# EAGLE schematic LSPPM (EAGLE 9.5.0), part 2 of 2
## Sheet 18 of 19
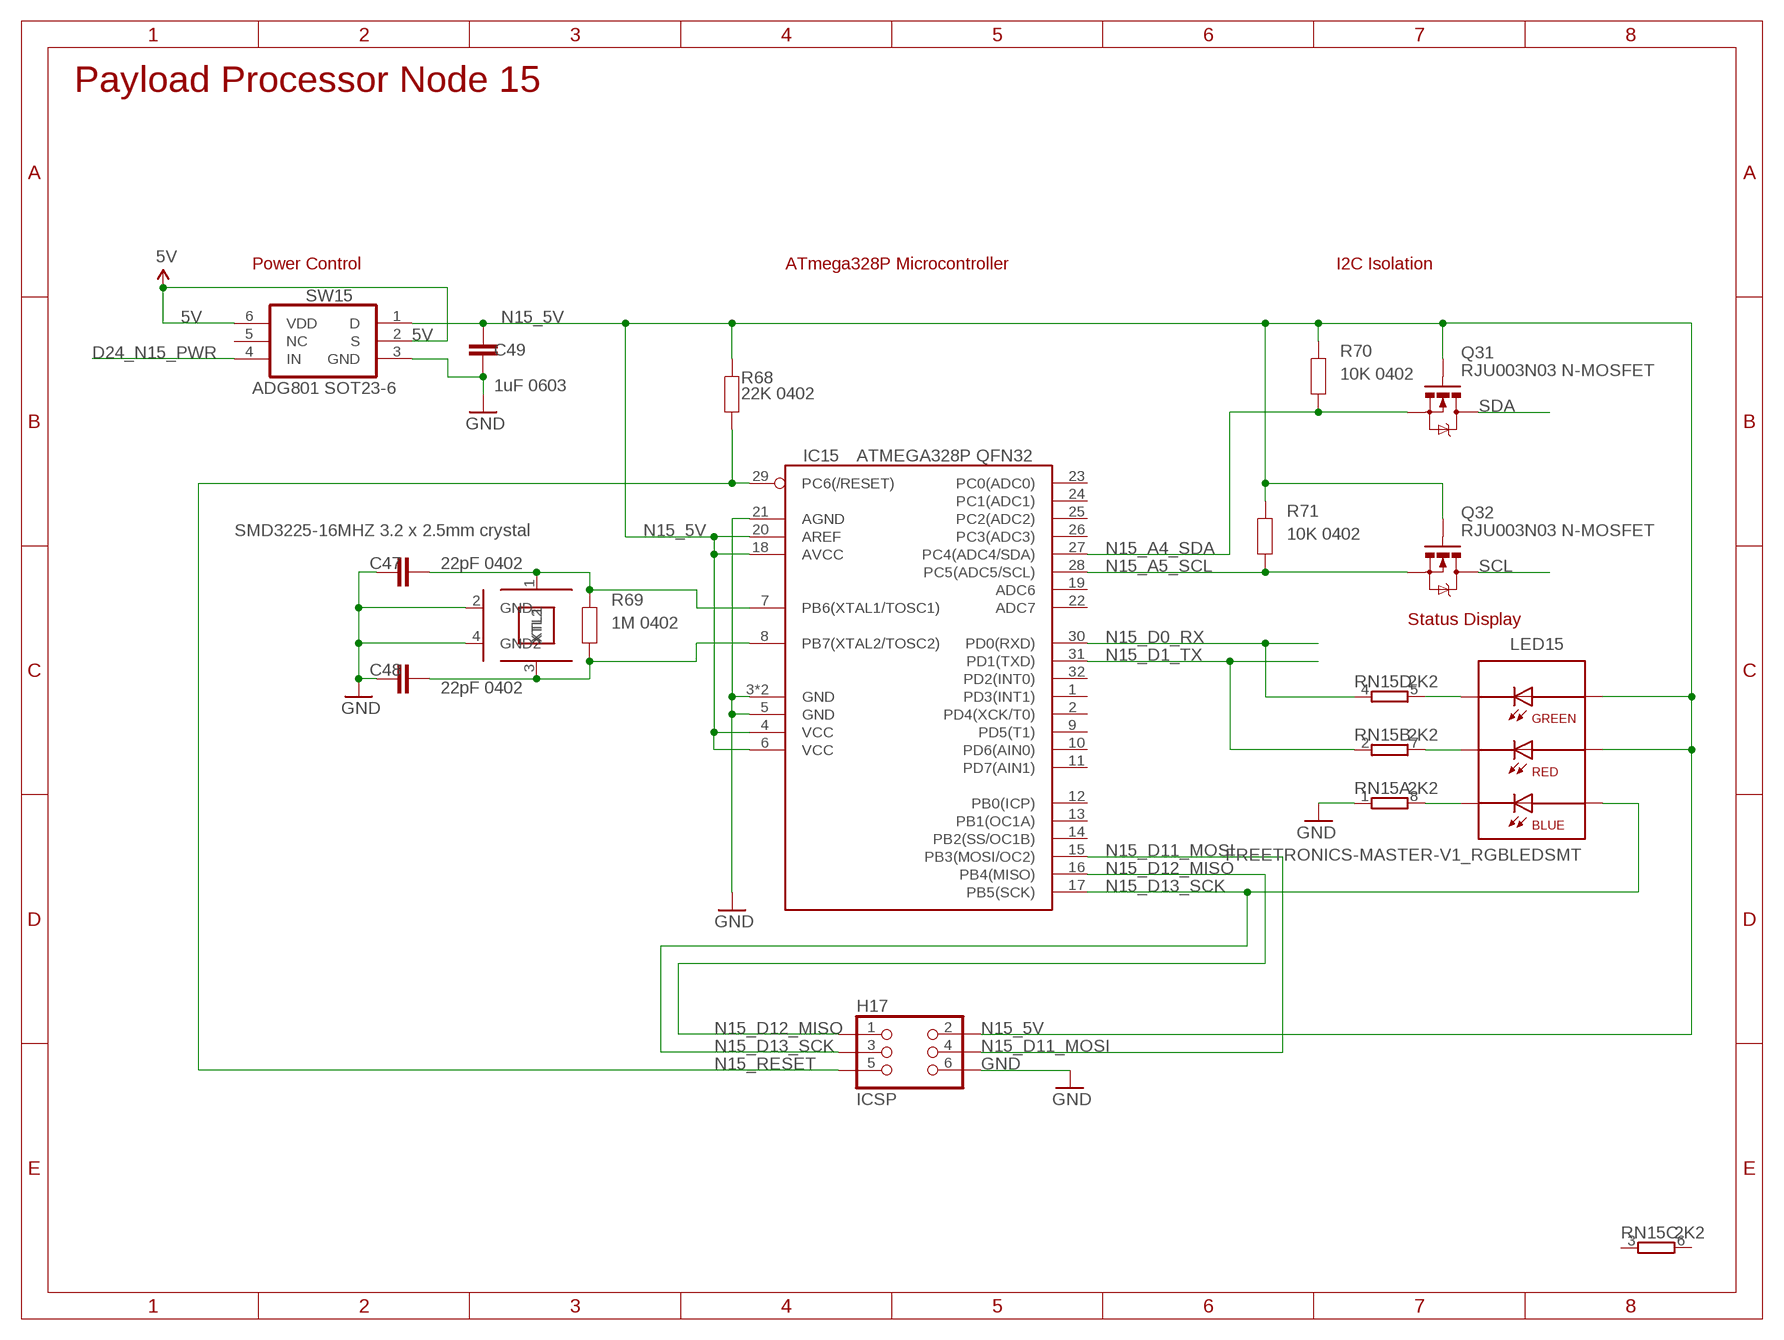
[diagram p17: schematic, sheet 18]

### Parts
C47  22pF 0402  CAP0402  [C0402]
C48  22pF 0402  CAP0402  [C0402]
C49  1uF 0603  CAP0603  [C0603]
H17  ICSP  ICSP2X3-2MM  [M2X3-2MM]
IC15  ATMEGA328P QFN32  ATMEGA8-MLF  [MLF32]
LED15  FREETRONICS-MASTER-V1_RGBLEDSMT  [FREETRONICS-MASTER-V1_19-337]
Q31  RJU003N03 N-MOSFET  MOSFET-NCHANNEL-323  [SOT32-3]
Q32  RJU003N03 N-MOSFET  MOSFET-NCHANNEL-323  [SOT32-3]
R68  22K 0402  RESISTOR0402  [R0402]
R69  1M 0402  RESISTOR0402  [R0402]
R70  10K 0402  RESISTOR0402  [R0402]
R71  10K 0402  RESISTOR0402  [R0402]
RN15  2K2  4R-NCAY16  [CAY16]
SW15  ADG801 SOT23-6  ADG801SOT23-6  [SOT23-6]
XTL15  SMD3225-16MHZ 3.2 x 2.5mm crystal  CRYSTAL-GND3X2  [CRYSTAL-SMD-3X2]

### Nets
5V: SW15.2(S) SW15.6(VDD) ; also sheet 1,2,3,4,5,6,7,8,9,10,11,12,13,14,15,16,17,19
D24_N15_PWR: SW15.4(IN) ; also sheet 2
GND: C47.1 C48.1 C49.2 H17.6 IC15.3(GND) IC15.5(GND) IC15.21(AGND) IC15.TGND(GND) RN15.1 SW15.3(GND) XTL15.2(GND) XTL15.4(GND2) ; also sheet 1,2,3,4,5,6,7,8,9,10,11,12,13,14,15,16,17,19
N15_5V: C49.1 H17.2 IC15.4(VCC) IC15.6(VCC) IC15.18(AVCC) IC15.20(AREF) LED15.5(A-R) LED15.6(A-G) Q31.1(G) Q32.1(G) R68.2 R70.2 R71.2 SW15.1(D)
N15_A4_SDA: IC15.27(PC4(ADC4/SDA)) Q31.2(S) R70.1
N15_A5_SCL: IC15.28(PC5(ADC5/SCL)) Q32.2(S) R71.1
N15_D0_RX: IC15.30(PD0(RXD)) RN15.4 ; also sheet 2
N15_D1_TX: IC15.31(PD1(TXD)) RN15.2 ; also sheet 2
N15_D11_MOSI: H17.4 IC15.15(PB3(MOSI/OC2))
N15_D12_MISO: H17.1 IC15.16(PB4(MISO))
N15_D13_SCK: H17.3 IC15.17(PB5(SCK)) LED15.4(A-B)
N15_RESET: H17.5 IC15.29(PC6(/RESET)) R68.1 ; also sheet 3
N$8822: C48.2 IC15.8(PB7(XTAL2/TOSC2)) R69.1 XTL15.3(XTL2)
N$8823: C47.2 IC15.7(PB6(XTAL1/TOSC1)) R69.2 XTL15.1(XTL1)
N$8824: LED15.2(C-R) RN15.7
N$8825: LED15.1(C-B) RN15.8
N$8826: LED15.3(C-G) RN15.5
SCL: Q32.3(D) ; also sheet 1,2,3,4,5,6,7,8,9,10,11,12,13,14,15,16,17,19
SDA: Q31.3(D) ; also sheet 1,2,3,4,5,6,7,8,9,10,11,12,13,14,15,16,17,19
Unconnected: IC15.1(PD3(INT1)) IC15.2(PD4(XCK/T0)) IC15.9(PD5(T1)) IC15.10(PD6(AIN0)) IC15.11(PD7(AIN1)) IC15.12(PB0(ICP)) IC15.13(PB1(OC1A)) IC15.14(PB2(SS/OC1B)) IC15.19(ADC6) IC15.22(ADC7) IC15.23(PC0(ADC0)) IC15.24(PC1(ADC1)) IC15.25(PC2(ADC2)) IC15.26(PC3(ADC3)) IC15.32(PD2(INT0)) RN15.3 RN15.6 SW15.5(NC)

### Notes on the sheet
- Payload Processor Node 15
- Power Control | ATmega328P Microcontroller | I2C Isolation
- SMD3225-16MHZ 3.2 x 2.5mm crystal
- Status Display

## Sheet 19 of 19
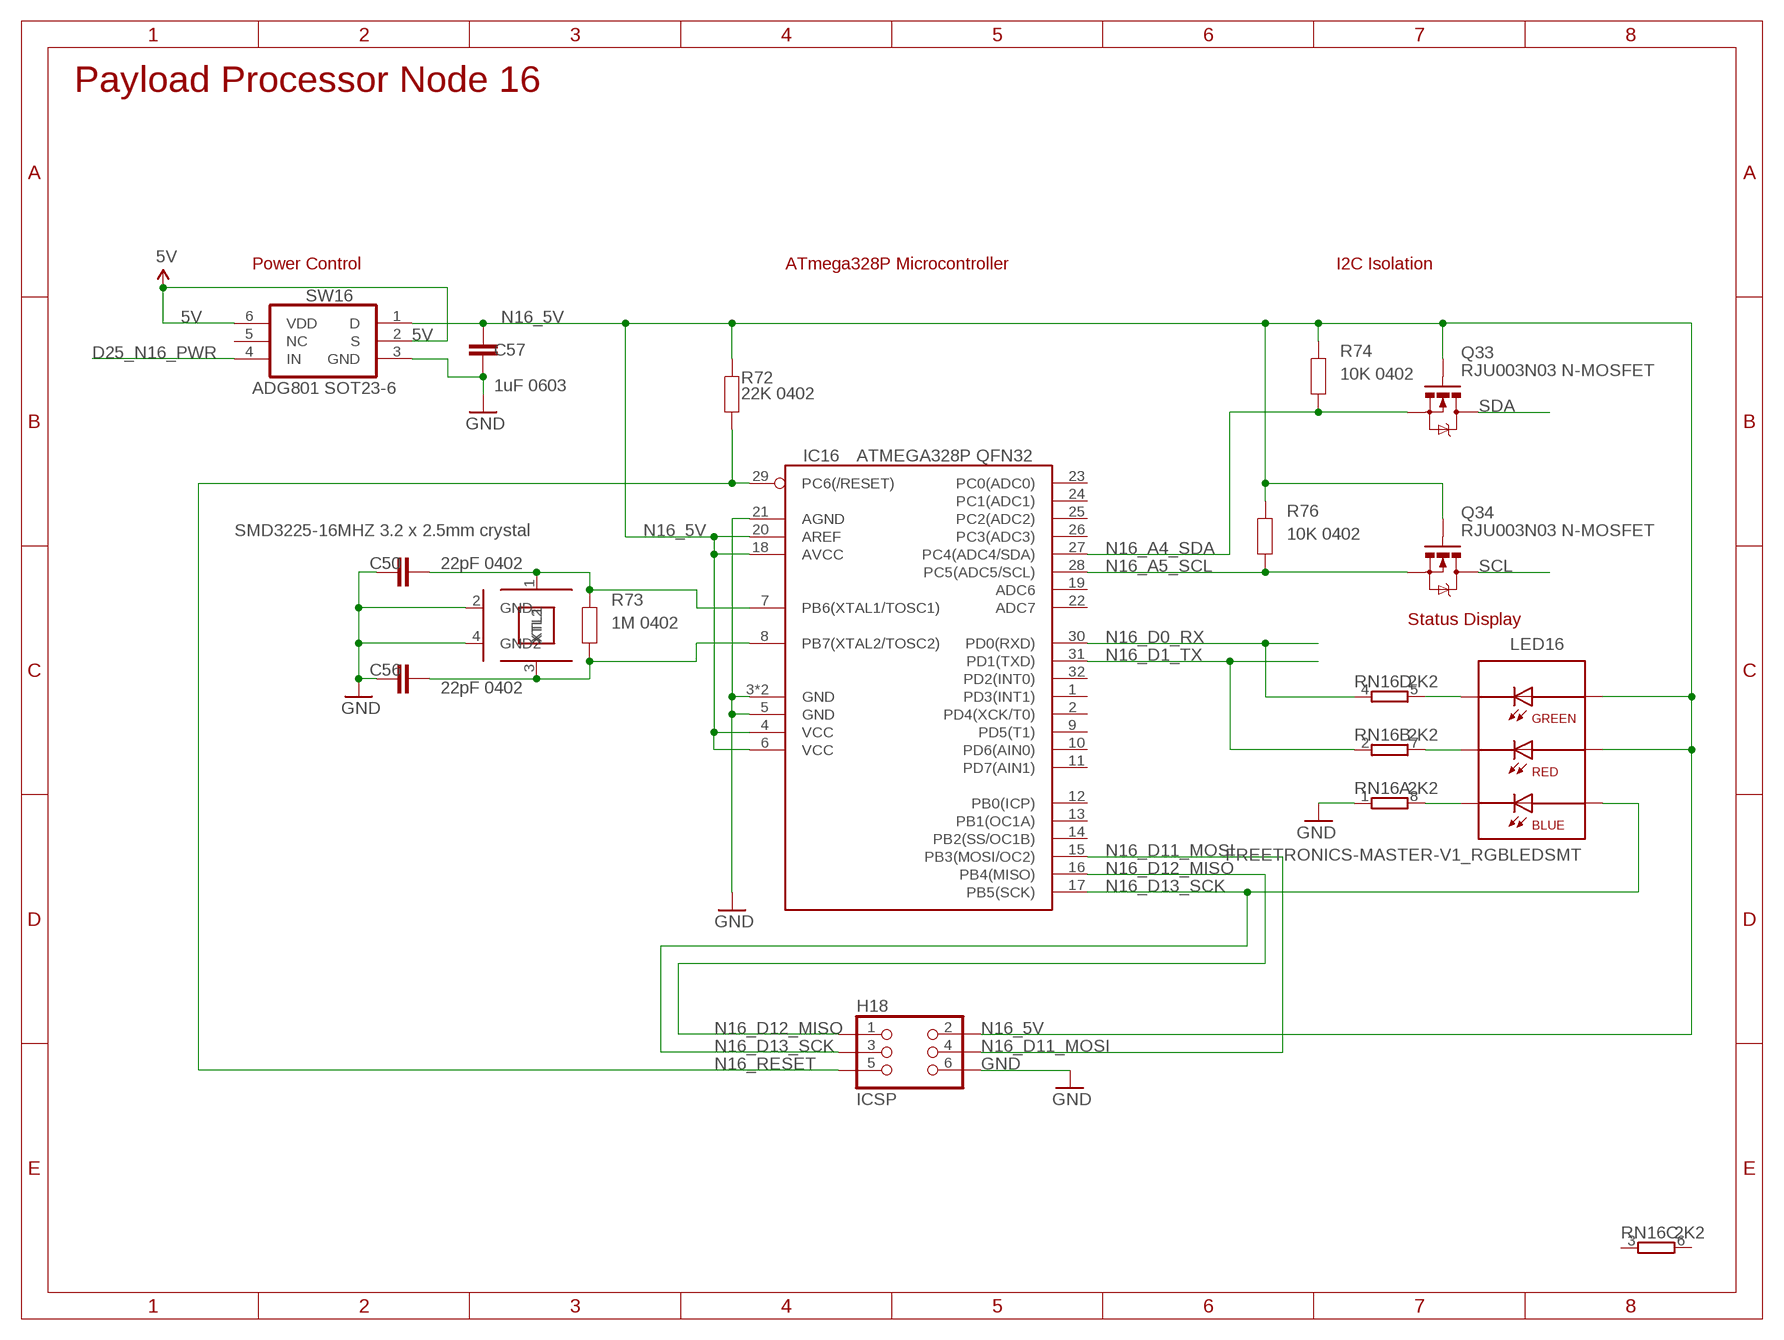
[diagram p18: schematic, sheet 19]

### Parts
C50  22pF 0402  CAP0402  [C0402]
C56  22pF 0402  CAP0402  [C0402]
C57  1uF 0603  CAP0603  [C0603]
H18  ICSP  ICSP2X3-2MM  [M2X3-2MM]
IC16  ATMEGA328P QFN32  ATMEGA8-MLF  [MLF32]
LED16  FREETRONICS-MASTER-V1_RGBLEDSMT  [FREETRONICS-MASTER-V1_19-337]
Q33  RJU003N03 N-MOSFET  MOSFET-NCHANNEL-323  [SOT32-3]
Q34  RJU003N03 N-MOSFET  MOSFET-NCHANNEL-323  [SOT32-3]
R72  22K 0402  RESISTOR0402  [R0402]
R73  1M 0402  RESISTOR0402  [R0402]
R74  10K 0402  RESISTOR0402  [R0402]
R76  10K 0402  RESISTOR0402  [R0402]
RN16  2K2  4R-NCAY16  [CAY16]
SW16  ADG801 SOT23-6  ADG801SOT23-6  [SOT23-6]
XTL16  SMD3225-16MHZ 3.2 x 2.5mm crystal  CRYSTAL-GND3X2  [CRYSTAL-SMD-3X2]

### Nets
5V: SW16.2(S) SW16.6(VDD) ; also sheet 1,2,3,4,5,6,7,8,9,10,11,12,13,14,15,16,17,18
D25_N16_PWR: SW16.4(IN) ; also sheet 2
GND: C50.1 C56.1 C57.2 H18.6 IC16.3(GND) IC16.5(GND) IC16.21(AGND) IC16.TGND(GND) RN16.1 SW16.3(GND) XTL16.2(GND) XTL16.4(GND2) ; also sheet 1,2,3,4,5,6,7,8,9,10,11,12,13,14,15,16,17,18
N16_5V: C57.1 H18.2 IC16.4(VCC) IC16.6(VCC) IC16.18(AVCC) IC16.20(AREF) LED16.5(A-R) LED16.6(A-G) Q33.1(G) Q34.1(G) R72.2 R74.2 R76.2 SW16.1(D)
N16_A4_SDA: IC16.27(PC4(ADC4/SDA)) Q33.2(S) R74.1
N16_A5_SCL: IC16.28(PC5(ADC5/SCL)) Q34.2(S) R76.1
N16_D0_RX: IC16.30(PD0(RXD)) RN16.4 ; also sheet 2
N16_D1_TX: IC16.31(PD1(TXD)) RN16.2 ; also sheet 2
N16_D11_MOSI: H18.4 IC16.15(PB3(MOSI/OC2))
N16_D12_MISO: H18.1 IC16.16(PB4(MISO))
N16_D13_SCK: H18.3 IC16.17(PB5(SCK)) LED16.4(A-B)
N16_RESET: H18.5 IC16.29(PC6(/RESET)) R72.1 ; also sheet 3
N$9410: C56.2 IC16.8(PB7(XTAL2/TOSC2)) R73.1 XTL16.3(XTL2)
N$9411: C50.2 IC16.7(PB6(XTAL1/TOSC1)) R73.2 XTL16.1(XTL1)
N$9412: LED16.2(C-R) RN16.7
N$9413: LED16.1(C-B) RN16.8
N$9414: LED16.3(C-G) RN16.5
SCL: Q34.3(D) ; also sheet 1,2,3,4,5,6,7,8,9,10,11,12,13,14,15,16,17,18
SDA: Q33.3(D) ; also sheet 1,2,3,4,5,6,7,8,9,10,11,12,13,14,15,16,17,18
Unconnected: IC16.1(PD3(INT1)) IC16.2(PD4(XCK/T0)) IC16.9(PD5(T1)) IC16.10(PD6(AIN0)) IC16.11(PD7(AIN1)) IC16.12(PB0(ICP)) IC16.13(PB1(OC1A)) IC16.14(PB2(SS/OC1B)) IC16.19(ADC6) IC16.22(ADC7) IC16.23(PC0(ADC0)) IC16.24(PC1(ADC1)) IC16.25(PC2(ADC2)) IC16.26(PC3(ADC3)) IC16.32(PD2(INT0)) RN16.3 RN16.6 SW16.5(NC)

### Notes on the sheet
- Payload Processor Node 16
- Power Control | ATmega328P Microcontroller | I2C Isolation
- SMD3225-16MHZ 3.2 x 2.5mm crystal
- Status Display

## Library data of the parts
C1-C58 C61 C62 = SuperHouse-DiscreteSemi:CAP: Capacitor Standard ceramic capacitor
C59 C60 = SuperHouse-DiscreteSemi:CAP_POL: Capacitor Polarized These are standard SMD and PTH capacitors. Normally 10uF, 47uF, and 100uF in electrolytic and tantalum varieties. Always verify the external diameter of the through hole cap, it varies with capacity, voltage, and manufacturer. The EIA devices should be standard.
FID1-FID8 = freetronics:FIDUCIAL: Fiducial Alignment Points Various fiducial points for machine vision alignment.
H1 H2 = SuperHouse-Connectors:CUBESATBUS: CubeSat Bus header
H3-H18 = freetronics-jon:ICSP
H19 = SuperHouse-Connectors:ICSP
IC1-IC16 = SuperHouse-MCUs:ATMEGA8: MICROCONTROLLER 8 Kbytes FLASH 1 kbytes SRAM 512 bytes EEPROM USART 6-channel 10 bit ADC 2-channel 8 bit ADC
IC17 = freetronics-jon:TXB0104
IC18 IC19 = SuperHouse-Sensors:TMP102
IC20 = freetronics-jon:ATMEGA2561*: MICROCONTROLLER 256 Kbytes FLASH 4 Kbytes EEPROM 8 Kbytes SRAM 54 General Purpose I/O pins 6-channels 16-bit PWM 2 x Serial USARTs 8-channels 10-bit A/D
IC21 IC22 = freetronics-jon:MAX4372
IC23 IC24 = freetronics-jon:MUX-74HC4067-QFN
IC25 = freetronics-jon:TCA9555
JP1 = SuperHouse-Connectors:M06: 6-way header Standard 1x6 header, and screw terminal variations
LED1-LED16 = freetronics-master-v1:FREETRONICS-MASTER-V1_RGBLED
LED17 LED18 = SuperHouse-LEDs:LED: LEDs Standard schematic elements and footprints for 5mm, 3mm, 1206, and 0603 sized LEDs. 5mm - Spark Fun Electronics SKU : COM-00529 (and others)
MNT1-MNT4 = freetronics-jon:HOLE
P1 = SuperHouse-Connectors:USD-SOCKET: microSD Socket Push-push type uSD socket. Schematic element and footprint production proven. Spark Fun Electronics SKU : PRT-00127. tDoc lines correctly indicate media card edge positions when inserting (unlocked, locked, depressed).
Q1-Q46 = SuperHouse-DiscreteSemi:MOSFET-NCHANNEL: N-channel MOSFET
R1-R90 = SuperHouse-DiscreteSemi:RESISTOR: Resistor Standard resistors.
RN1-RN18 = SuperHouse-DiscreteSemi:4R-N: Array Chip Resistor Source: RS Component / Phycomp
SJ1-SJ4 = freetronics-master-v1.1:SJ: SMD solder JUMPER
SJ5 SJ6 = freetronics-jon:SJ: SMD solder JUMPER
SJ7-SJ9 = freetronics-jon:SJC
SW1-SW16 SW18 = freetronics-jon:ADG801
SW17 = SuperHouse-Switches:TAC_SWITCH_2PIN: Momentary Tactile Switch - 2 pin Uxcell 3x4x2mm switch with 2 SMT pads
X1 = SuperHouse-Connectors:PICOBLADE-53?-06: CONNECTOR wire to board 1.25 mm (.049 inch) pitch header; MF: MOLEX; OC_FARNELL: 1125368; OC_NEWARK: unknown
X2 = SuperHouse-Connectors:PICOBLADE-53?-08: CONNECTOR wire to board 1.25 mm (.049 inch) pitch header; MF: MOLEX; OC_FARNELL: 1125371; OC_NEWARK: unknown
X3 = SuperHouse-Connectors:PICOBLADE-53?-07: CONNECTOR wire to board 1.25 mm (.049 inch) pitch header; MF: MOLEX; OC_FARNELL: 9786368; OC_NEWARK: unknown
X4 = con-molex:53?-04: CONNECTOR wire to board 1.25 mm (.049 inch) pitch header; MF: MOLEX; OC_FARNELL: 1125367; OC_NEWARK: unknown
XTL1-XTL17 = SuperHouse-Oscillators:CRYSTAL-GND: 3x2mm SMT crystal